# Altium project amplificador.PrjPcb
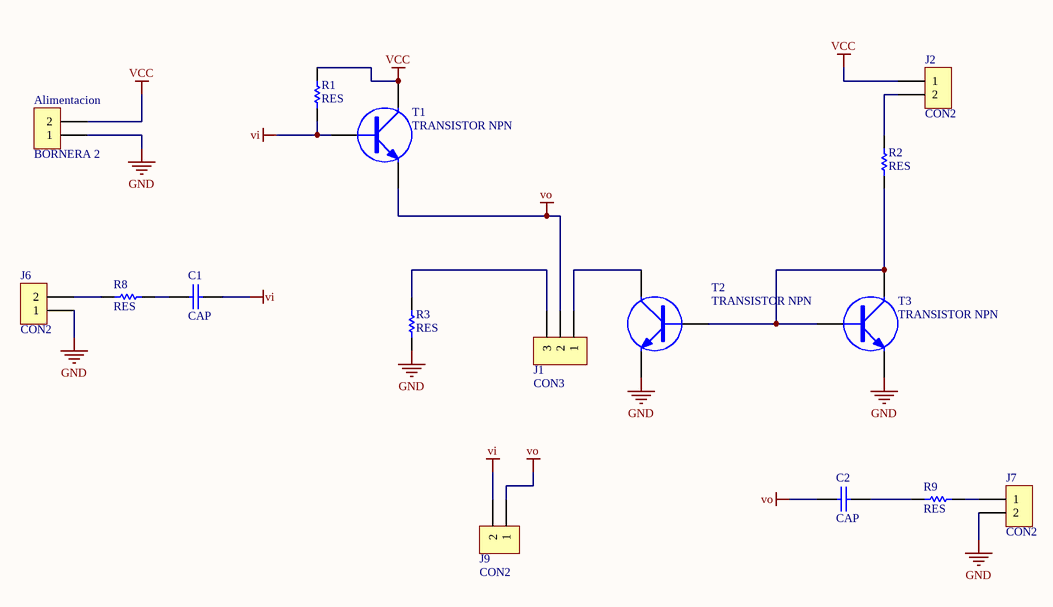
[diagram p0: esquematico.SchDoc]
1 sheet, 16 parts. Net scope: global (net labels, ports and power ports of the same name join across sheets).
Board file: PCB1.PcbDoc

## Sheet esquematico.SchDoc
size A4

### Parts
Alimentacion  BORNERA 2  [BORNERA2]
C1  CAP  [CAP200]
C2  CAP  [CAP200]
J1  CON3  [SIP3]
J2  CON2  [SIP2]
J6  CON2  [SIP2]
J7  CON2  [SIP2]
J9  CON2  [SIP2]
R1  RES  [RES400]
R2  RES  [RES400]
R3  RES  [RES400]
R8  RES  [RES400]
R9  RES  [RES400]
T1  TRANSISTOR NPN  [TO92]
T2  TRANSISTOR NPN  [TO92]
T3  TRANSISTOR NPN  [TO92]

### Nets
GND: Alimentacion.1 J6.1 J7.2 R3.1 T2.3(E) T3.3(E)
VCC: Alimentacion.2 J2.1 R1.2 T1.2(C)
vi: C1.2 J9.2 R1.1 T1.1(B)
vo: C2.1 J1.2 J9.1 T1.3(E)
NetC1_1: C1.1 R8.2
NetC2_2: C2.2 R9.1
NetJ1_1: J1.1 T2.2(C)
NetJ1_3: J1.3 R3.2
NetJ2_2: J2.2 R2.2
NetJ6_2: J6.2 R8.1
NetJ7_1: J7.1 R9.2
NetR2_1: R2.1 T2.1(B) T3.1(B) T3.2(C)